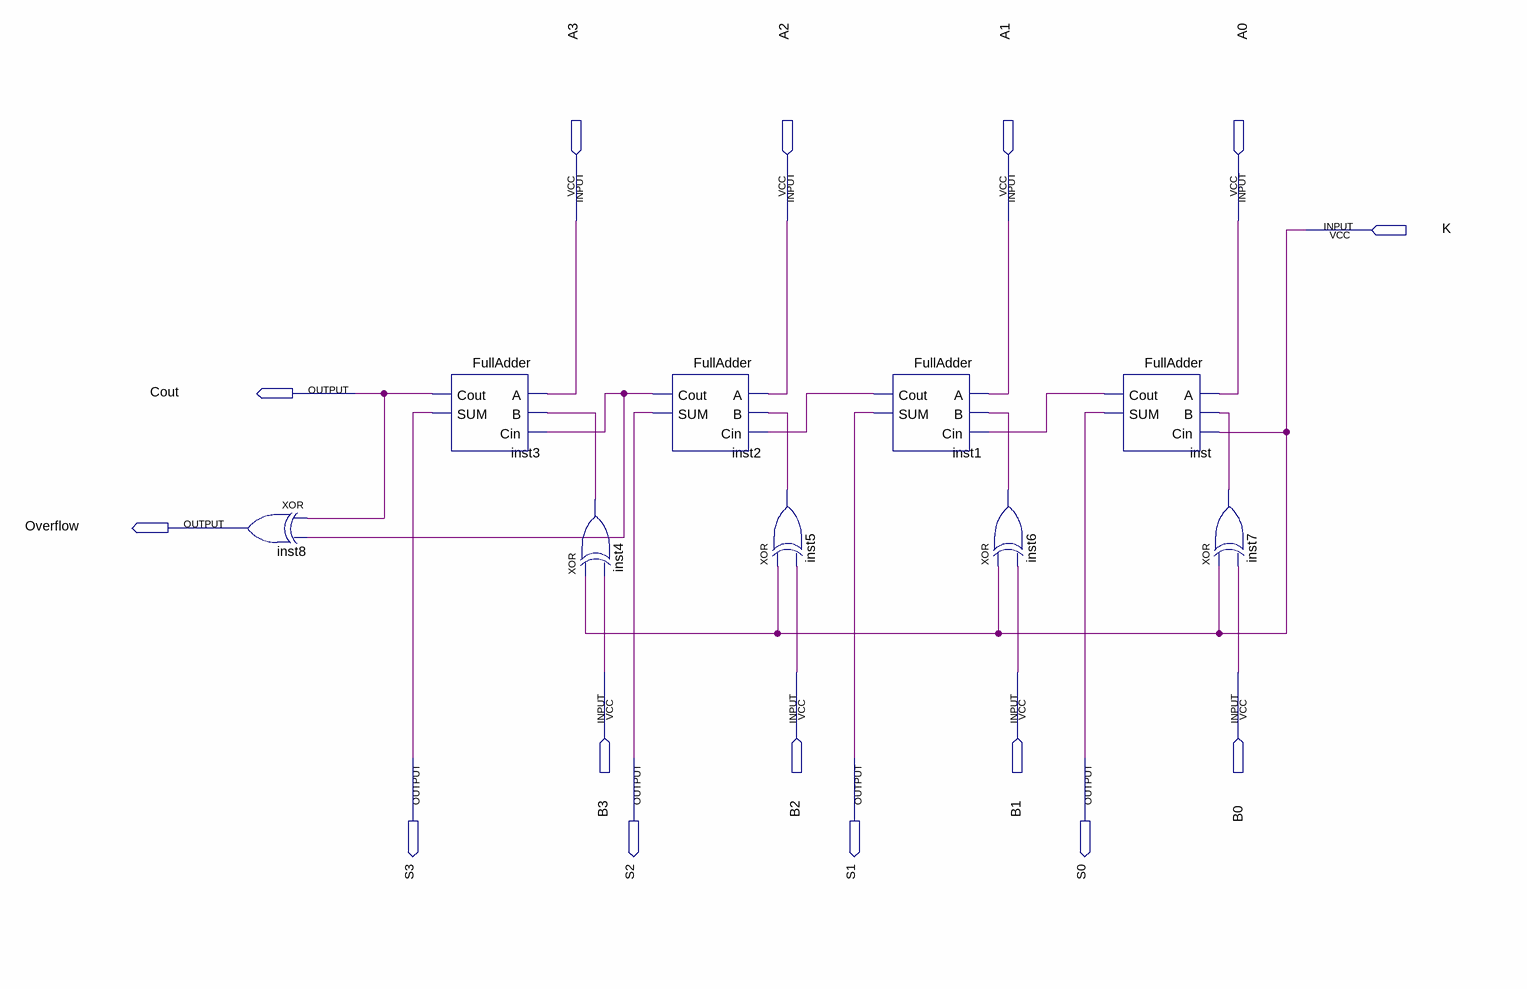
[diagram p0: schematic sheet]
// Quartus schematic AddSub4.bdf as structural Verilog: 9 symbols, 15 pins
module AddSub4 (
  input  A3,
  input  A2,
  input  A1,
  input  A0,
  input  K,
  input  B3,
  input  B2,
  input  B1,
  input  B0,
  output Cout,
  output Overflow,
  output S3,
  output S2,
  output S1,
  output S0
);

  wire inst1_cout, inst2_cout, inst4_out, inst5_out, inst6_out, inst7_out, inst_cout;

  xor inst8 (Overflow, Cout, inst2_cout);
  FullAdder inst3 (.A(A3), .B(inst4_out), .Cin(inst2_cout), .Cout(Cout), .SUM(S3));
  xor inst4 (inst4_out, K, B3);
  FullAdder inst2 (.A(A2), .B(inst5_out), .Cin(inst1_cout), .Cout(inst2_cout), .SUM(S2));
  xor inst5 (inst5_out, K, B2);
  FullAdder inst1 (.A(A1), .B(inst6_out), .Cin(inst_cout), .Cout(inst1_cout), .SUM(S1));
  xor inst6 (inst6_out, K, B1);
  FullAdder inst (.A(A0), .B(inst7_out), .Cin(K), .Cout(inst_cout), .SUM(S0));
  xor inst7 (inst7_out, K, B0);
endmodule
